# EAGLE design elekey (EAGLE 6.5.0)
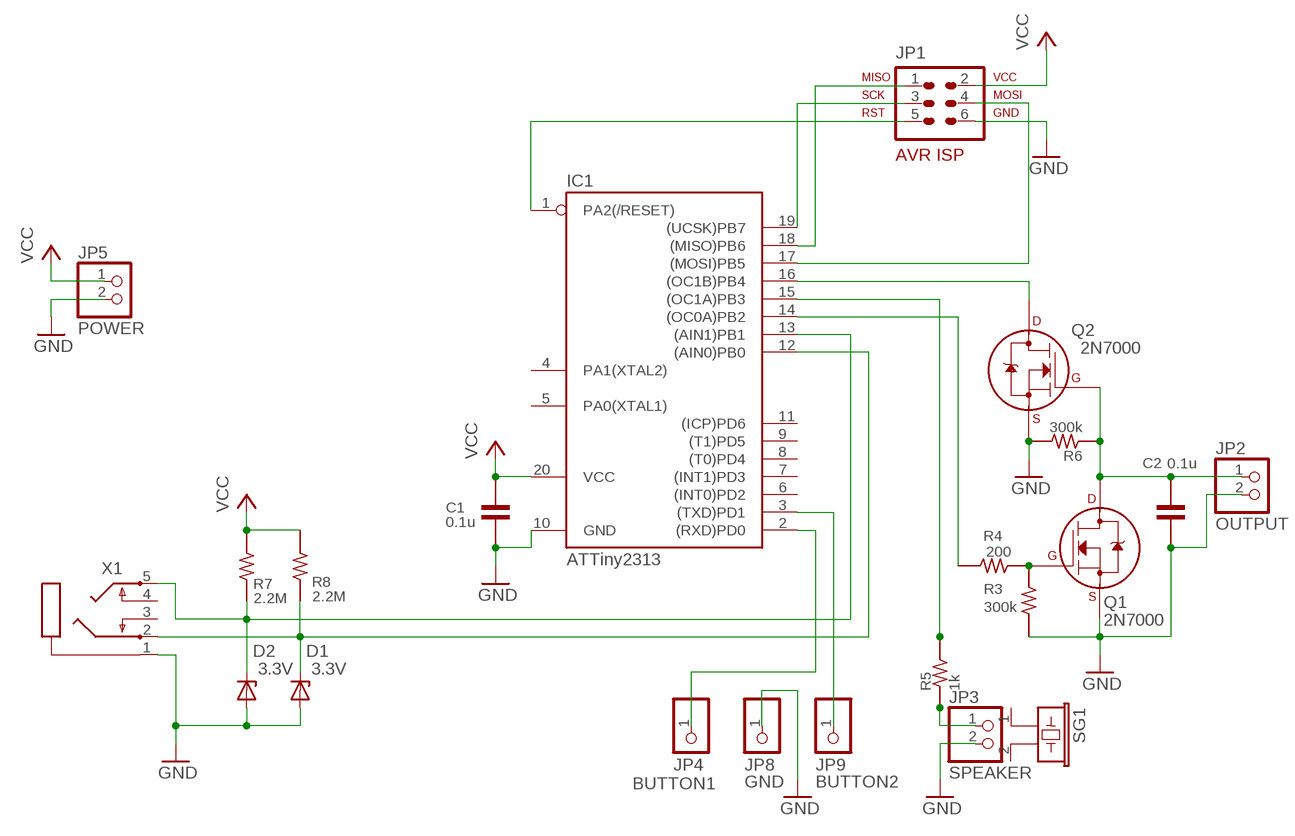
[diagram p0: schematic, sheet 1]

## Parts
C1  0.1u  C-50V-0302-2.54  [50-0302-2.54]
C2  0.1u  C-50V-0302-5.08  [50-0302-5.08]
D1  3.3V  ZENER-DIODEZD-5  [ZDIO-5]
D2  3.3V  ZENER-DIODEZD-5  [ZDIO-5]
IC1  ATTiny2313  TINY2313-*P*  [DIL20]
JP1  AVR-ISP-6VERT  [AVR-ISP-6]
JP2  OUTPUT  PINHD-1X2  [1X02]
JP3  SPEAKER  PINHD-1X2  [1X02]
JP4  BUTTON1  PINHD-1X1  [1X01]
JP5  POWER  PINHD-1X2  [1X02]
JP8  GND  PINHD-1X1  [1X01]
JP9  BUTTON2  PINHD-1X1  [1X01]
Q1  2N7000  2N7000_TO92  [TO-92]
Q2  2N7000  2N7000_TO92  [TO-92]
R3  300k  R-1/4W-02.54-V  [1/4W-2.54V]
R4  200  R-1/4W-07.62  [1/4W-7.62H]
R5  1k  R-1/4W-05.08-V  [1/4W-5.08V]
R6  300k  R-1/4W-05.08-V  [1/4W-5.08V]
R7  2.2M  R-1/4W-10.16  [1/4W-10.16H]
R8  2.2M  R-1/4W-07.62  [1/4W-7.62H]
SG1  EFBRD24C411  [EFBRD24C411]
X1  PG203J  [PG203J]

## Nets
GND: C1.PAD2 C2.PAD2 D1.A D2.A IC1.10(GND) JP1.6 JP2.2 JP3.2 JP5.2 JP8.1 Q1.1(S) Q2.1(S) R3.PAD2 R6.PAD2 X1.1
N$1: D1.C IC1.12((AIN0)PB0) R8.PAD1 X1.2
N$2: D2.C IC1.13((AIN1)PB1) R7.PAD1 X1.5
N$3: IC1.18((MISO)PB6) JP1.1
N$4: IC1.1(PA2(/RESET)) JP1.5
N$5: IC1.19((UCSK)PB7) JP1.3
N$6: IC1.17((MOSI)PB5) JP1.4
N$7: IC1.16((OC1B)PB4) Q2.3(D)
N$8: C2.PAD1 JP2.1 Q1.3(D) Q2.2(G) R6.PAD1
N$9: Q1.2(G) R3.PAD1 R4.PAD1
N$10: IC1.15((OC1A)PB3) R5.PAD2
N$11: IC1.14((OC0A)PB2) R4.PAD2
N$12: JP3.1 R5.PAD1
N$13: IC1.2((RXD)PD0) JP4.1
N$14: IC1.3((TXD)PD1) JP9.1
VCC: C1.PAD1 IC1.20(VCC) JP1.2 JP5.1 R7.PAD2 R8.PAD2
Unconnected: IC1.4(PA1(XTAL2)) IC1.5(PA0(XTAL1)) IC1.6((INT0)PD2) IC1.7((INT1)PD3) IC1.8((T0)PD4) IC1.9((T1)PD5) IC1.11((ICP)PD6) SG1.1 SG1.2 X1.3 X1.4

## Library data of the parts
C1 C2 = c-j:C-: CAPACITOR Japanese symbol
D1 D2 = diode:ZENER-DIODE: Z-Diode
IC1 = avr-7:TINY2313*: Atmel Tiny2313 2K Flash, 128 bytes EEPROM, 128 bytes RAM
JP1 = avr-7:AVR-ISP-6: AVR ISP-6 Serial Programming Header
JP2 JP3 JP5 = pinhead:PINHD-1X2: PIN HEADER
JP4 JP8 JP9 = pinhead:PINHD-1X1: PIN HEADER
Q1 Q2 = transistors:2N700*: 2N7000, 2N7002, NDS7002A N-channel enhancement mode MOSFET
R3-R8 = r-j:R-: RESISTOR Japanese symbol
SG1 = buzzer:EFB?: Piezoelectric Acoustic Transducer Source: Panbasonic .. 2SC1685.pdf; OC_FARNELL: unknown; OC_NEWARK: unknown
X1 = con-hirschmann:PG203J: MIC/HEADPHONE JACK KS-S stereo microphone/headphone jack PG203JN (Schukat); OC_FARNELL: unknown; OC_NEWARK: unknown

## Net classes
0 default: width 0.813 mm

## Board
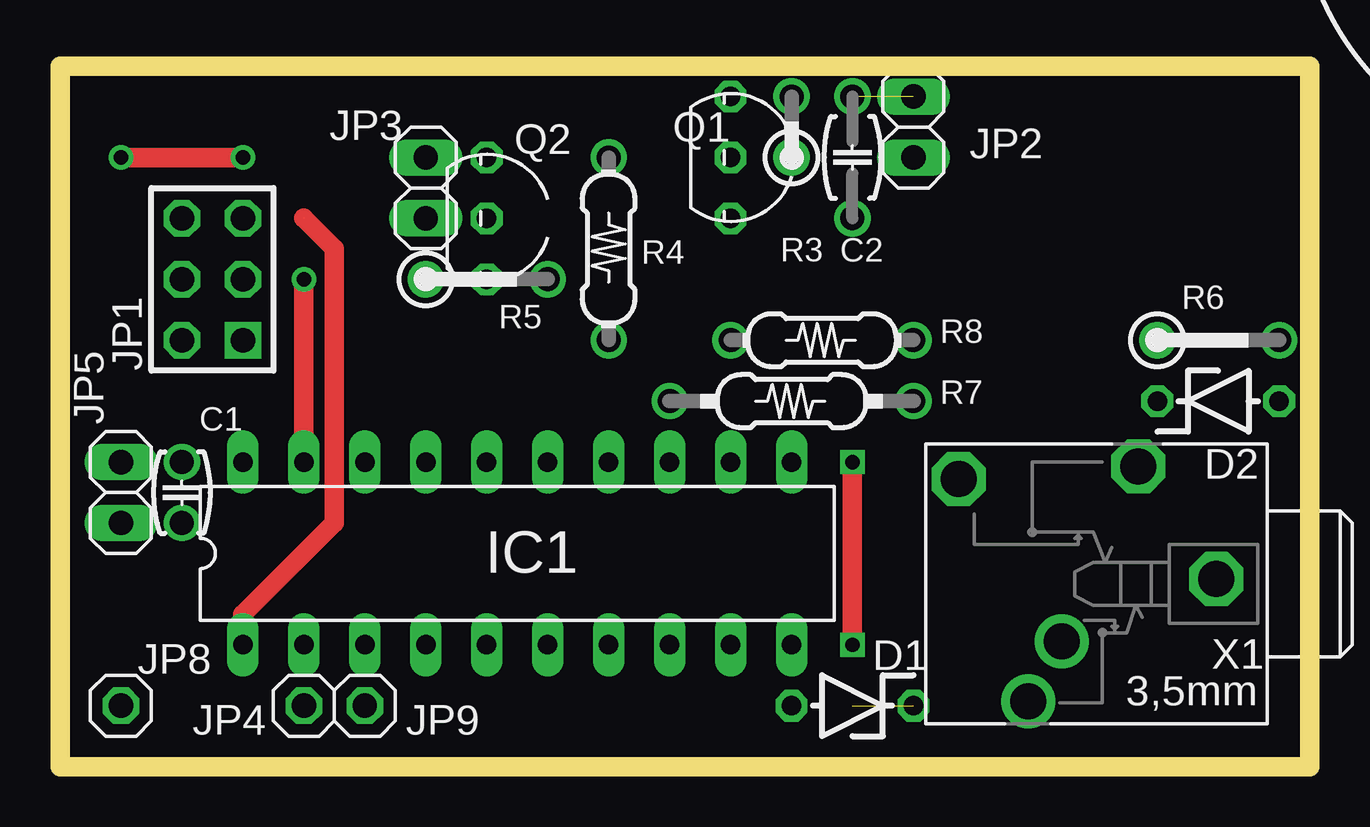
[diagram p1: board, top side]
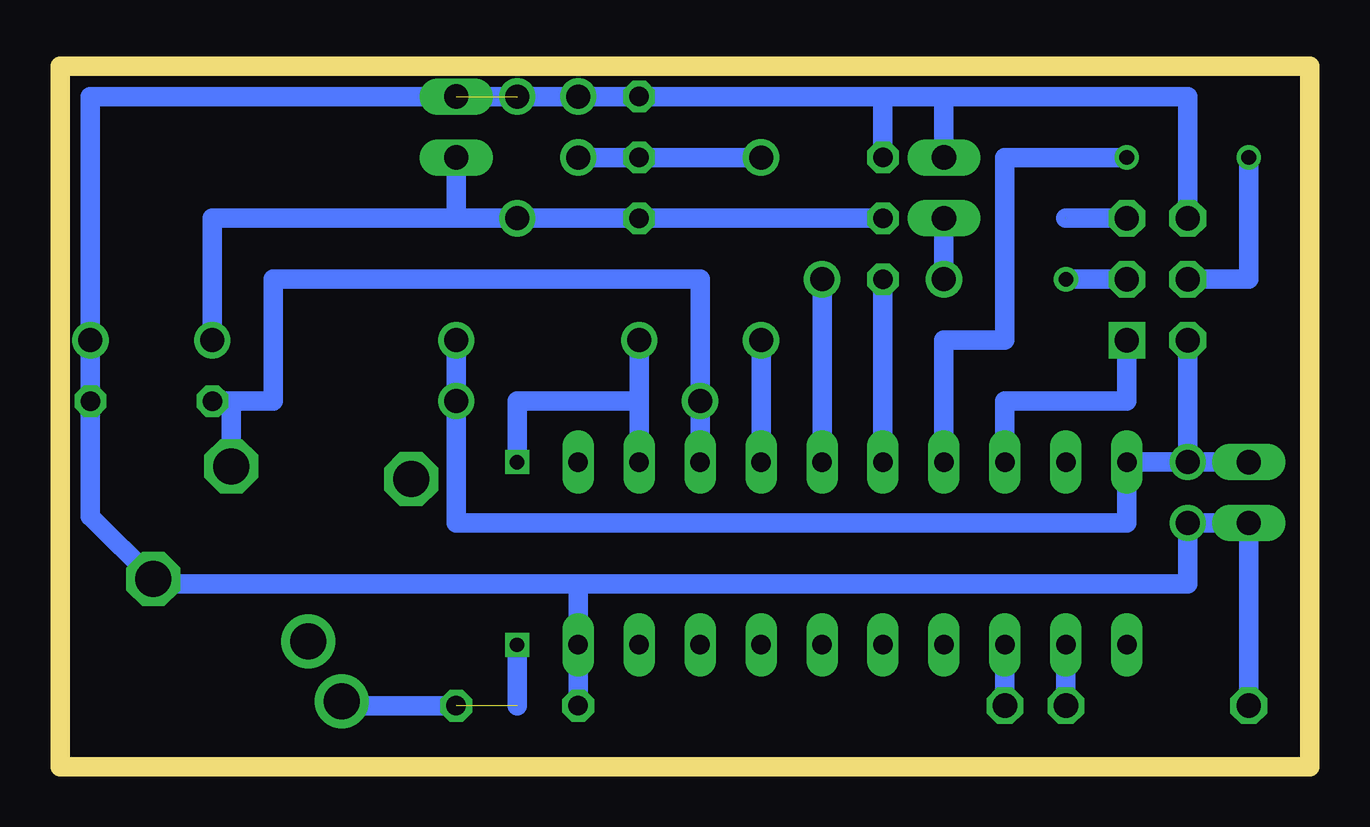
[diagram p2: board, bottom side, seen from below]

Size 52.07 x 29.21 mm. Coordinates in mm from the lower left corner, seen from the top.
Outline: 0,0 0,29.21 52.07,29.21 52.07,0 0,0
Copper layers (1*16): Top 0.035mm / dielectric 1.5mm / Bottom 0.035mm
Design rules "default": minimum track width 10mil, minimum drill 24mil, track to track 8mil, track to pad 8mil, pad to pad 8mil, via to via 8mil, smd to smd 8mil, copper to edge 40mil, drill to drill 8mil, minimum pad ring 10mil, minimum via ring 8mil, stop-mask expansion 4mil, vias tented up to drill 0mil, thermal gap 10mil

### Footprints (pad centres in the part's own frame; a part is rotated, then mirrored left to right if it is on the bottom)
50-0302-2.54 = drill 1: PAD1 -1.27,0; PAD2 1.27,0
50-0302-5.08 = drill 1: PAD1 -2.54,0; PAD2 2.54,0
ZDIO-5 = drill 0.813 octagon: A 2.54,0; C -2.54,0
DIL20 = drill 0.813 long: 1 -11.43,-3.81; 2 -8.89,-3.81; 3 -6.35,-3.81; 4 -3.81,-3.81; 5 -1.27,-3.81; 6 1.27,-3.81; 7 3.81,-3.81; 8 6.35,-3.81; 9 8.89,-3.81; 10 11.43,-3.81; 11 11.43,3.81; 12 8.89,3.81; 13 6.35,3.81; 14 3.81,3.81; 15 1.27,3.81; 16 -1.27,3.81; 17 -3.81,3.81; 18 -6.35,3.81; 19 -8.89,3.81; 20 -11.43,3.81
AVR-ISP-6 = drill 1.016 square: 1 -2.54,-1.27 | drill 1.016 octagon: 2 -2.54,1.27; 3 0,-1.27; 4 0,1.27; 5 2.54,-1.27; 6 2.54,1.27
1X02 = drill 1.016 long: 1 -1.27,0; 2 1.27,0
1X01 = drill 1.016 octagon: 1 0,0
TO-92 = drill 0.813 octagon: 1 -2.54,0; 2 0,0; 3 2.54,0
1/4W-2.54V = drill 1: PAD1 0,0; PAD2 2.54,0
1/4W-7.62H = drill 1: PAD1 -3.81,0; PAD2 3.81,0
1/4W-5.08V = drill 1: PAD1 0,0; PAD2 5.08,0
1/4W-10.16H = drill 1: PAD1 -5.08,0; PAD2 5.08,0
EFBRD24C411 = drill 1.1 pad 1.676: 1 -5,0; 2 5,0
PG203J = drill 1.499 octagon: 1 -5.004,-0.203; 4 5.74,-4.369; 5 -1.753,-4.902 | drill 1.499: 2 2.845,4.902; 3 1.448,2.388

### Placement (x,y rotation side)
C1  5.08,11.43 270 top
C2  33.02,25.4 90 top
D1  33.02,2.54 180 top
D2  48.26,15.24 0 top
IC1  19.05,8.89 0 top
JP1  6.35,20.32 90 top
JP2  35.56,26.67 90 top
JP3  15.24,24.13 90 top
JP4  10.16,2.54 0 top
JP5  2.54,11.43 270 top
JP8  2.54,2.54 0 top
JP9  12.7,2.54 0 top
Q1  27.94,25.4 270 top
Q2  17.78,22.86 270 top
R3  30.48,25.4 90 top
R4  22.86,21.59 270 top
R5  15.24,20.32 0 top
R6  45.72,17.78 0 top
R7  30.48,15.24 0 top
R8  31.75,17.78 0 top
SG1  63.5,36.83 180 top  (outside the outline)
X1  43.18,7.62 180 top

### Tracks (layer width: path | path; a pad name or v marks a point on that pad's centre or on a via)
GND  (1 unrouted)
  Bottom 0.813: 30.48,7.62 5.08,7.62 C1.PAD2 JP5.2 JP8.1 | 30.48,7.62 IC1.10 D1.A | 30.48,7.62 48.18,7.62 X1.1 50.8,10.44 D2.A R6.PAD2 50.8,27.94 C2.PAD2 R3.PAD2 Q1.1 17.78,27.94 | JP3.2 15.24,27.94 | 15.24,27.94 5.08,27.94 JP1.6 | Q2.1 17.78,27.94 | 17.78,27.94 15.24,27.94
N$1  (via drill 0.6)  (1 unrouted)
  Top 0.813: v33.02,12.7 v33.02,5.08
  Bottom 0.813: R8.PAD1 IC1.12 27.94,15.24 33.02,15.24 v33.02,12.7 | v33.02,5.08 33.02,2.54 | 40.16,2.54 arc90 X1.2 40.34,2.54 D1.C
N$2
  Bottom 0.813: IC1.13 R7.PAD1 25.4,20.32 43.18,20.32 43.18,15.24 44.93,15.24 | 44.93,15.24 X1.5 | D2.C 44.93,15.24
N$3
  Bottom 0.813: JP1.1 7.62,15.24 12.7,15.24 IC1.18
N$4  (1 unrouted)
  Top 0.813: 10.16,22.86 11.43,21.59 11.43,10.16 7.62,6.35 IC1.1
  Bottom 0.813: JP1.5 10.16,22.86
N$5  (via drill 0.61)
  Top 0.813: v10.16,20.32 IC1.19
  Bottom 0.813: JP1.3 v10.16,20.32
N$6  (via drill 0.61)
  Top 0.813: v2.54,25.4 v7.62,25.4
  Bottom 0.813: IC1.17 15.24,17.78 12.7,17.78 12.7,25.4 v7.62,25.4 | v2.54,25.4 2.54,20.32 JP1.4
N$7
  Bottom 0.813: IC1.16 Q2.3
N$8
  Bottom 0.813: Q2.2 Q1.3 C2.PAD1 35.56,22.86 | 35.56,22.86 JP2.1 | R6.PAD1 45.72,22.86 35.56,22.86
N$9
  Bottom 0.813: R4.PAD1 Q1.2 R3.PAD1
N$10
  Bottom 0.813: IC1.15 R5.PAD2
N$11
  Bottom 0.813: IC1.14 R4.PAD2
N$12  (via drill 0.6)
  Bottom 0.813: R5.PAD1 JP3.1
  other vias: 15.24,22.86
N$13
  Bottom 0.813: JP4.1 IC1.2
N$14
  Bottom 0.813: JP9.1 IC1.3
VCC
  Bottom 0.813: C1.PAD1 IC1.20 7.62,10.16 35.56,10.16 R7.PAD2 R8.PAD2 | C1.PAD1 JP5.1 | C1.PAD1 JP1.2